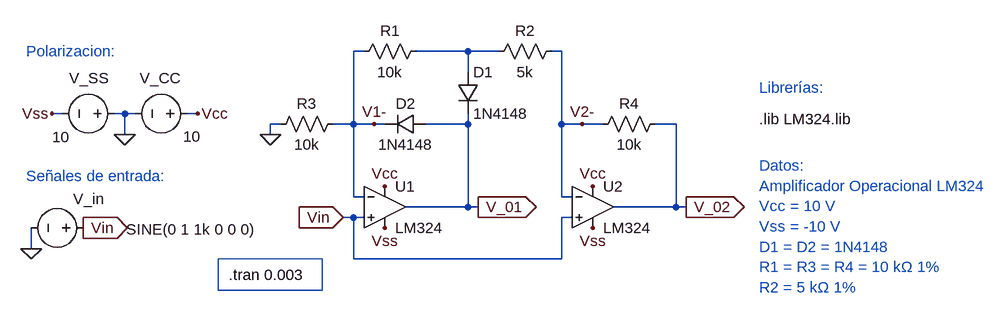
[diagram p0: schematic Lab_1_Circ_3.asc]
Lab_1_Circ_3.asc, the LTspice schematic file:
Version 4
SHEET 1 1560 680
WIRE 192 -320 176 -320
WIRE 352 -320 272 -320
WIRE 400 -320 352 -320
WIRE 496 -320 480 -320
WIRE 352 -288 352 -320
WIRE -272 -224 -288 -224
WIRE -176 -224 -192 -224
WIRE -160 -224 -176 -224
WIRE -64 -224 -80 -224
WIRE 64 -208 48 -208
WIRE 176 -208 176 -320
WIRE 176 -208 144 -208
WIRE 208 -208 176 -208
WIRE 224 -208 208 -208
WIRE 352 -208 352 -224
WIRE 352 -208 288 -208
WIRE 496 -208 496 -320
WIRE 528 -208 496 -208
WIRE 560 -208 528 -208
WIRE 672 -208 640 -208
WIRE -176 -192 -176 -224
WIRE 48 -192 48 -208
WIRE 176 -96 176 -208
WIRE 192 -96 176 -96
WIRE 496 -96 496 -208
WIRE 512 -96 496 -96
WIRE 352 -80 352 -208
WIRE 352 -80 256 -80
WIRE 368 -80 352 -80
WIRE 672 -80 672 -208
WIRE 672 -80 576 -80
WIRE 688 -80 672 -80
WIRE 176 -64 160 -64
WIRE 192 -64 176 -64
WIRE 512 -64 496 -64
WIRE -320 -16 -320 -48
WIRE 176 0 176 -64
WIRE 496 0 496 -64
WIRE 496 0 176 0
FLAG 48 -192 0
FLAG -64 -224 Vcc
FLAG 224 -112 Vcc
FLAG -288 -224 Vss
FLAG 224 -48 Vss
FLAG -176 -192 0
FLAG -320 -16 0
FLAG 688 -80 V_02
IOPIN 688 -80 Out
FLAG 160 -64 Vin
IOPIN 160 -64 In
FLAG -240 -48 Vin
IOPIN -240 -48 Out
FLAG 368 -80 V_01
IOPIN 368 -80 Out
FLAG 544 -112 Vcc
FLAG 544 -48 Vss
FLAG 208 -208 V1-
FLAG 528 -208 V2-
SYMBOL OpAmps\\opamp2 224 -144 R0
SYMATTR InstName U1
SYMATTR Value LM324
SYMBOL res 176 -304 R270
WINDOW 0 32 56 VTop 2
WINDOW 3 0 56 VBottom 2
SYMATTR InstName R1
SYMATTR Value 10k
SYMBOL res 384 -304 R270
WINDOW 0 32 56 VTop 2
WINDOW 3 0 56 VBottom 2
SYMATTR InstName R2
SYMATTR Value 5k
SYMBOL res 160 -224 R90
WINDOW 0 0 56 VBottom 2
WINDOW 3 32 56 VTop 2
SYMATTR InstName R3
SYMATTR Value 10k
SYMBOL res 544 -192 R270
WINDOW 0 32 56 VTop 2
WINDOW 3 0 56 VBottom 2
SYMATTR InstName R4
SYMATTR Value 10k
SYMBOL voltage -224 -48 M270
WINDOW 0 45 31 VLeft 2
WINDOW 3 -2 -50 VLeft 2
WINDOW 123 0 0 Left 0
WINDOW 39 0 0 Left 0
SYMATTR InstName V_in
SYMATTR Value SINE(0 1 1k 0 0 0)
SYMBOL voltage -64 -224 R90
WINDOW 0 -55 25 VRight 2
WINDOW 3 35 -5 VRight 2
WINDOW 123 0 0 Left 0
WINDOW 39 0 0 Left 0
SYMATTR InstName V_CC
SYMATTR Value 10
SYMBOL voltage -176 -224 R90
WINDOW 0 -55 25 VRight 2
WINDOW 3 36 85 VRight 2
WINDOW 123 0 0 Left 0
WINDOW 39 0 0 Left 0
SYMATTR InstName V_SS
SYMATTR Value 10
SYMBOL OpAmps\\opamp2 544 -144 R0
SYMATTR InstName U2
SYMATTR Value LM324
SYMBOL diode 336 -288 R0
SYMATTR InstName D1
SYMATTR Value 1N4148
SYMBOL diode 288 -224 R90
WINDOW 0 0 32 VBottom 2
WINDOW 3 32 32 VTop 2
SYMATTR InstName D2
SYMATTR Value 1N4148
TEXT 800 -216 Left 2 !.lib LM324.lib
TEXT 800 -264 Left 2 ;Librerías:
TEXT -16 24 Left 2 !.tran 0.003
TEXT -328 -320 Left 2 ;Polarizacion:
TEXT -328 -128 Left 2 ;Señales de entrada:
TEXT 800 -144 Left 2 ;Datos:\nAmplificador Operacional LM324\nVcc = 10 V\nVss = -10 V\nD1 = D2 = 1N4148\nR1 = R3 = R4 = 10 kΩ 1%\nR2 = 5 kΩ 1%
RECTANGLE Normal 128 48 -32 0

The netlist it stands for:
* Lab_1_Circ_3.asc
XU1 Vin V1- Vcc Vss V_01 LM324  ; pins In+ In- V+ V- OUT
R1 V1- N001 10k
R2 N001 V2- 5k
R3 V1- 0 10k
R4 V2- V_02 10k
V_in Vin 0 SINE(0 1 1k 0 0 0)
V_CC Vcc 0 10
V_SS 0 Vss 10
XU2 Vin V2- Vcc Vss V_02 LM324  ; pins In+ In- V+ V- OUT
D1 N001 V_01 1N4148
D2 V_01 V1- 1N4148
.model D D
.lib standard.dio
.lib LM324.lib
* Librerías:
.tran 0.003
* Polarizacion:
* Señales de entrada:
* Datos:
* Amplificador Operacional LM324
* Vcc = 10 V
* Vss = -10 V
* D1 = D2 = 1N4148
* R1 = R3 = R4 = 10 kΩ 1%
* R2 = 5 kΩ 1%
.backanno
.end